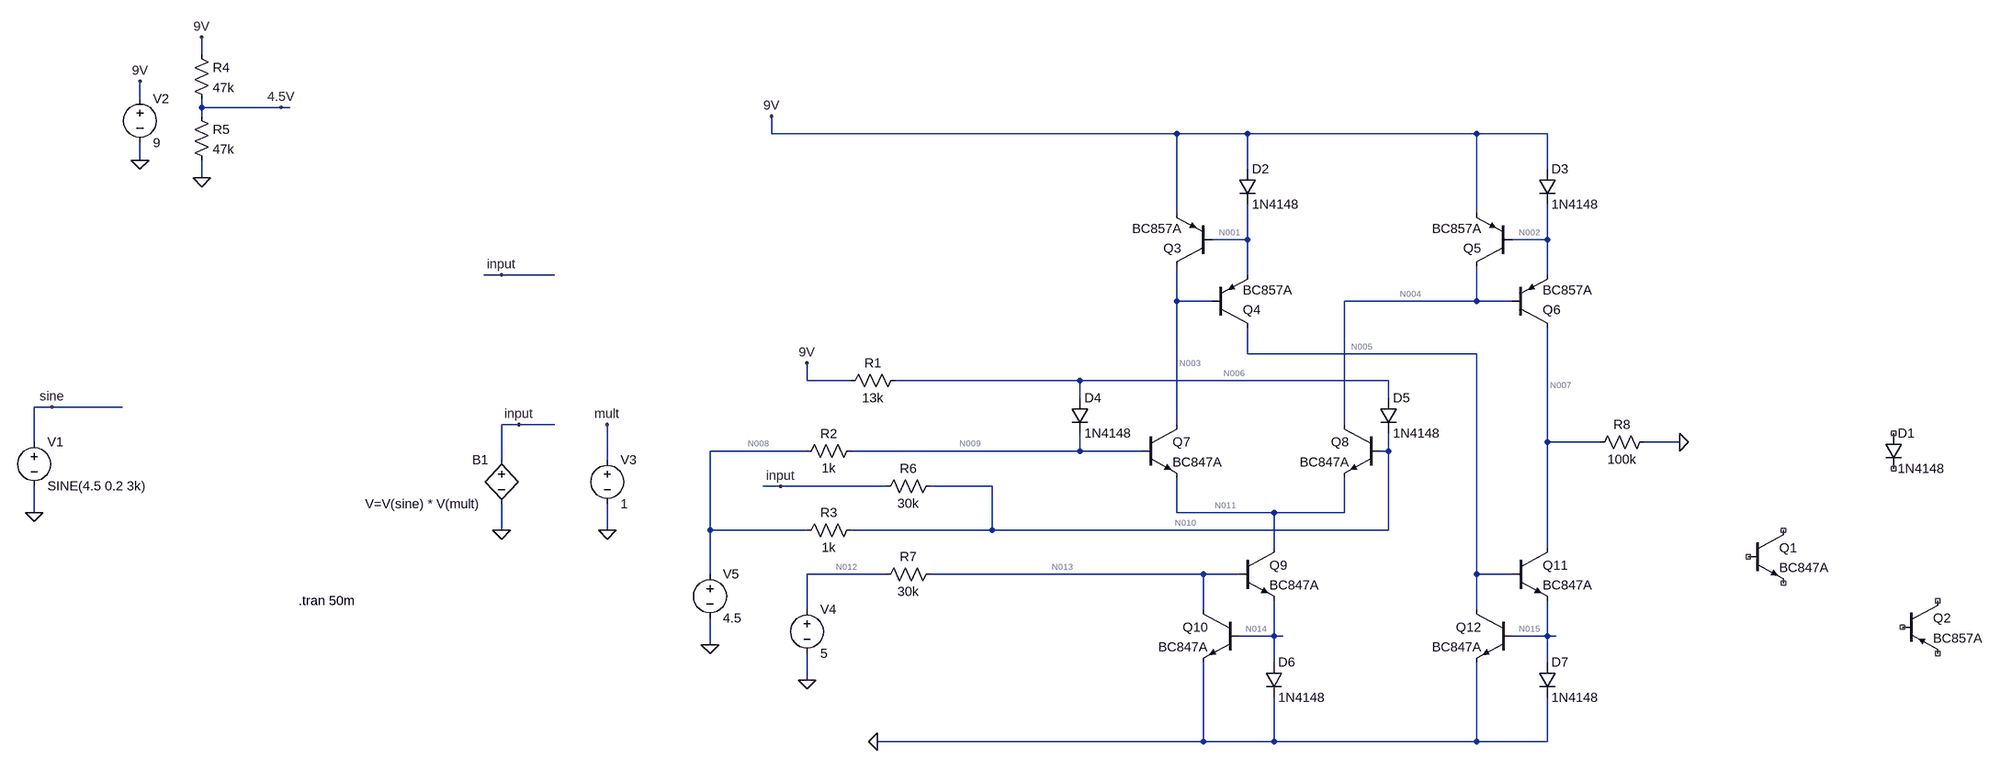
[diagram p0: schematic LM13700.asc]
LM13700.asc, the LTspice schematic file:
Version 4
SHEET 1 4932 2324
WIRE -656 -464 -656 -496
WIRE -768 -384 -768 -416
WIRE -656 -368 -656 -384
WIRE -512 -368 -656 -368
WIRE -496 -368 -512 -368
WIRE -656 -352 -656 -368
WIRE 400 -320 400 -352
WIRE 1152 -320 400 -320
WIRE 1280 -320 1152 -320
WIRE 1696 -320 1280 -320
WIRE 1824 -320 1696 -320
WIRE -768 -272 -768 -304
WIRE 1280 -256 1280 -320
WIRE 1824 -256 1824 -320
WIRE -656 -240 -656 -272
WIRE 1152 -176 1152 -320
WIRE 1696 -176 1696 -320
WIRE 1280 -128 1280 -192
WIRE 1280 -128 1216 -128
WIRE 1824 -128 1824 -192
WIRE 1824 -128 1760 -128
WIRE -112 -64 -144 -64
WIRE -16 -64 -112 -64
WIRE 1280 -64 1280 -128
WIRE 1824 -64 1824 -128
WIRE 1152 -16 1152 -80
WIRE 1216 -16 1152 -16
WIRE 1696 -16 1696 -80
WIRE 1696 -16 1456 -16
WIRE 1760 -16 1696 -16
WIRE 1280 80 1280 32
WIRE 1696 80 1280 80
WIRE 464 128 464 96
WIRE 544 128 464 128
WIRE 976 128 624 128
WIRE 1536 128 976 128
WIRE 976 160 976 128
WIRE 1536 160 1536 128
WIRE -928 176 -960 176
WIRE -800 176 -928 176
WIRE -80 208 -112 208
WIRE -16 208 -80 208
WIRE 1152 208 1152 -16
WIRE 1456 208 1456 -16
WIRE -960 240 -960 176
WIRE 1824 240 1824 32
WIRE 1920 240 1824 240
WIRE 2064 240 2000 240
WIRE 464 256 288 256
WIRE 976 256 976 224
WIRE 976 256 544 256
WIRE 1088 256 976 256
WIRE 1536 256 1536 224
WIRE 1536 256 1520 256
WIRE -112 272 -112 208
WIRE 80 272 80 208
WIRE 416 320 384 320
WIRE 608 320 416 320
WIRE 800 320 688 320
WIRE -960 368 -960 320
WIRE 1152 368 1152 304
WIRE 1328 368 1152 368
WIRE 1456 368 1456 304
WIRE 1456 368 1328 368
WIRE -112 400 -112 352
WIRE 80 400 80 352
WIRE 288 400 288 256
WIRE 464 400 288 400
WIRE 800 400 800 320
WIRE 800 400 544 400
WIRE 1536 400 1536 256
WIRE 1536 400 800 400
WIRE 1328 432 1328 368
WIRE 1824 432 1824 240
WIRE 288 480 288 400
WIRE 608 480 464 480
WIRE 1200 480 688 480
WIRE 1264 480 1200 480
WIRE 1696 480 1696 80
WIRE 1760 480 1696 480
WIRE 464 544 464 480
WIRE 1200 544 1200 480
WIRE 1696 544 1696 480
WIRE 1328 592 1328 528
WIRE 1328 592 1264 592
WIRE 1344 592 1328 592
WIRE 1824 592 1824 528
WIRE 1824 592 1760 592
WIRE 1840 592 1824 592
WIRE 288 608 288 560
WIRE 1328 640 1328 592
WIRE 1824 640 1824 592
WIRE 464 672 464 624
WIRE 1200 784 1200 640
WIRE 1200 784 592 784
WIRE 1328 784 1328 704
WIRE 1328 784 1200 784
WIRE 1696 784 1696 640
WIRE 1696 784 1328 784
WIRE 1824 784 1824 704
WIRE 1824 784 1696 784
FLAG -768 -416 9V
FLAG -768 -272 0
FLAG -656 -496 9V
FLAG -656 -240 0
FLAG -512 -368 4.5V
FLAG -960 368 0
FLAG 80 400 0
FLAG 80 208 mult
FLAG -112 400 0
FLAG -928 176 sine
FLAG -80 208 input
FLAG -112 -64 input
FLAG 592 784 0
FLAG 400 -352 9V
FLAG 464 96 9V
FLAG 416 320 input
FLAG 464 672 0
FLAG 288 608 0
FLAG 2064 240 0
SYMBOL voltage -960 224 R0
WINDOW 123 0 0 Left 0
WINDOW 39 0 0 Left 0
SYMATTR InstName V1
SYMATTR Value SINE(4.5 0.2 3k)
SYMBOL voltage -768 -400 R0
WINDOW 123 0 0 Left 0
WINDOW 39 0 0 Left 0
SYMATTR InstName V2
SYMATTR Value 9
SYMBOL res -672 -480 R0
SYMATTR InstName R4
SYMATTR Value 47k
SYMBOL res -672 -368 R0
SYMATTR InstName R5
SYMATTR Value 47k
SYMBOL voltage 80 256 R0
WINDOW 123 0 0 Left 0
WINDOW 39 0 0 Left 0
SYMATTR InstName V3
SYMATTR Value 1
SYMBOL bv -112 256 M0
WINDOW 3 40 96 Left 2
SYMATTR Value V=V(sine) * V(mult)
SYMATTR InstName B1
SYMBOL npn 2192 400 R0
SYMATTR InstName Q1
SYMATTR Value BC847A
SYMBOL pnp 2560 528 R0
SYMATTR InstName Q2
SYMATTR Value BC857A
SYMBOL diode 2528 224 R0
SYMATTR InstName D1
SYMATTR Value 1N4148
SYMBOL pnp 1216 -80 R180
SYMATTR InstName Q3
SYMATTR Value BC857A
SYMBOL pnp 1216 32 M180
SYMATTR InstName Q4
SYMATTR Value BC857A
SYMBOL diode 1264 -256 R0
SYMATTR InstName D2
SYMATTR Value 1N4148
SYMBOL pnp 1760 -80 R180
SYMATTR InstName Q5
SYMATTR Value BC857A
SYMBOL pnp 1760 32 M180
SYMATTR InstName Q6
SYMATTR Value BC857A
SYMBOL diode 1808 -256 R0
SYMATTR InstName D3
SYMATTR Value 1N4148
SYMBOL npn 1088 208 R0
SYMATTR InstName Q7
SYMATTR Value BC847A
SYMBOL diode 960 160 R0
SYMATTR InstName D4
SYMATTR Value 1N4148
SYMBOL npn 1520 208 M0
SYMATTR InstName Q8
SYMATTR Value BC847A
SYMBOL diode 1520 160 R0
SYMATTR InstName D5
SYMATTR Value 1N4148
SYMBOL npn 1264 432 R0
SYMATTR InstName Q9
SYMATTR Value BC847A
SYMBOL npn 1264 544 M0
SYMATTR InstName Q10
SYMATTR Value BC847A
SYMBOL diode 1312 640 R0
SYMATTR InstName D6
SYMATTR Value 1N4148
SYMBOL npn 1760 432 R0
SYMATTR InstName Q11
SYMATTR Value BC847A
SYMBOL npn 1760 544 M0
SYMATTR InstName Q12
SYMATTR Value BC847A
SYMBOL diode 1808 640 R0
SYMATTR InstName D7
SYMATTR Value 1N4148
SYMBOL res 640 112 R90
WINDOW 0 0 56 VBottom 2
WINDOW 3 32 56 VTop 2
SYMATTR InstName R1
SYMATTR Value 13k
SYMBOL res 560 240 R90
WINDOW 0 0 56 VBottom 2
WINDOW 3 32 56 VTop 2
SYMATTR InstName R2
SYMATTR Value 1k
SYMBOL res 560 384 R90
WINDOW 0 0 56 VBottom 2
WINDOW 3 32 56 VTop 2
SYMATTR InstName R3
SYMATTR Value 1k
SYMBOL res 704 304 R90
WINDOW 0 0 56 VBottom 2
WINDOW 3 32 56 VTop 2
SYMATTR InstName R6
SYMATTR Value 30k
SYMBOL voltage 464 528 R0
WINDOW 123 0 0 Left 0
WINDOW 39 0 0 Left 0
SYMATTR InstName V4
SYMATTR Value 5
SYMBOL res 592 496 R270
WINDOW 0 32 56 VTop 2
WINDOW 3 0 56 VBottom 2
SYMATTR InstName R7
SYMATTR Value 30k
SYMBOL voltage 288 464 R0
WINDOW 123 0 0 Left 0
WINDOW 39 0 0 Left 0
SYMATTR InstName V5
SYMATTR Value 4.5
SYMBOL res 2016 224 R90
WINDOW 0 0 56 VBottom 2
WINDOW 3 32 56 VTop 2
SYMATTR InstName R8
SYMATTR Value 100k
TEXT -480 528 Left 2 !.tran 50m

The netlist it stands for:
* LM13700.asc
V1 sine 0 SINE(4.5 0.2 3k)
V2 9V 0 9
R4 9V 4.5V 47k
R5 4.5V 0 47k
V3 mult 0 1
B1 input 0 V=V(sine) * V(mult)
Q1 NC_01 NC_02 NC_03 0 BC847A
Q2 NC_04 NC_05 NC_06 0 BC857A
D1 NC_07 NC_08 1N4148
Q3 N003 N001 9V 0 BC857A
Q4 N005 N003 N001 0 BC857A
D2 9V N001 1N4148
Q5 N004 N002 9V 0 BC857A
Q6 N007 N004 N002 0 BC857A
D3 9V N002 1N4148
Q7 N003 N009 N011 0 BC847A
D4 N006 N009 1N4148
Q8 N004 N010 N011 0 BC847A
D5 N006 N010 1N4148
Q9 N011 N013 N014 0 BC847A
Q10 N013 N014 0 0 BC847A
D6 N014 0 1N4148
Q11 N007 N005 N015 0 BC847A
Q12 N005 N015 0 0 BC847A
D7 N015 0 1N4148
R1 N006 9V 13k
R2 N009 N008 1k
R3 N010 N008 1k
R6 N010 input 30k
V4 N012 0 5
R7 N012 N013 30k
V5 N008 0 4.5
R8 0 N007 100k
.model D D
.lib standard.dio
.model NPN NPN
.model PNP PNP
.lib standard.bjt
.tran 50m
.backanno
.end

* Results of the author's LTspice run, read from the files saved beside the schematic
* Operating Point, zero values left out:
*   V(sine) = 4.5 V
*   V(9v) = 9 V
*   V(4.5v) = 4.5 V
*   V(mult) = 1 V
*   V(input) = 4.5 V
*   V(n003) = 7.681 V
*   V(n001) = 8.361 V
*   V(n005) = 1.394 V
*   V(n004) = 7.683 V
*   V(n002) = 8.362 V
*   V(n007) = 676.9 mV
*   V(n009) = 4.643 V
*   V(n011) = 4.003 V
*   V(n006) = 5.14 V
*   V(n010) = 4.642 V
*   V(n013) = 1.255 V
*   V(n014) = 596.4 mV
*   V(n015) = 659.7 mV
*   V(n008) = 4.5 V
*   V(n012) = 5 V
*   I(B1) = 4.734 µA
*   Ic(Q6) = -3.118 mA
*   Ib(Q6) = -18.48 µA
*   Ie(Q6) = 3.136 mA
*   Ic(Q5) = -606.7 µA
*   Ib(Q5) = -3.942 µA
*   Ie(Q5) = 610.6 µA
*   Ic(Q4) = -3.19 mA
*   Ib(Q4) = -19.13 µA
*   Ie(Q4) = 3.209 mA
*   Ic(Q3) = -632.1 µA
*   Ib(Q3) = -4.107 µA
*   Ie(Q3) = 636.2 µA
*   Ic(Q12) = 1.319 mA
*   Ib(Q12) = 7.433 µA
*   Ie(Q12) = -1.326 mA
*   Ic(Q11) = 3.111 mA
*   Ib(Q11) = 1.871 mA
*   Ie(Q11) = -4.982 mA
*   Ic(Q10) = 117.7 µA
*   Ib(Q10) = 657 nA
*   Ie(Q10) = -118.4 µA
*   Ic(Q9) = 1.283 mA
*   Ib(Q9) = 7.129 µA
*   Ie(Q9) = -1.291 mA
*   Ic(Q8) = 625.2 µA
*   Ib(Q8) = 3.447 µA
*   Ie(Q8) = -628.6 µA
*   Ic(Q7) = 651.2 µA
*   Ib(Q7) = 3.592 µA
*   Ie(Q7) = -654.8 µA
*   I(D7) = 4.974 mA
*   I(D6) = 1.29 mA
*   I(D5) = 150.2 µA
*   I(D4) = 146.7 µA
*   I(D3) = 3.132 mA
*   I(D2) = 3.205 mA
*   I(R8) = -6.769 µA
*   I(R7) = 124.8 µA
*   I(R6) = 4.734 µA
*   I(R3) = 142 µA
*   I(R2) = 143.1 µA
*   I(R1) = -296.9 µA
*   I(R5) = 95.74 µA
*   I(R4) = 95.74 µA
*   I(V5) = 285.1 µA
*   I(V4) = -124.8 µA
*   I(V2) = -7.976 mA
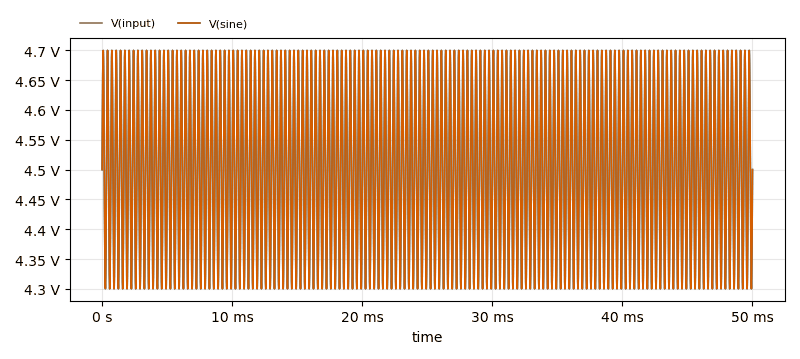
[diagram p1: Transient Analysis of LM13700.asc, plotted from the saved traces]
* Transient Analysis, 1 run:
*   V(input): min 4.3 V, max 4.7 V, average 4.5 V, rms 4.502 V, last 4.5 V
*   V(sine): min 4.3 V, max 4.7 V, average 4.5 V, rms 4.502 V, last 4.5 V